# EAGLE schematic TSALC (EAGLE 9.3.0)
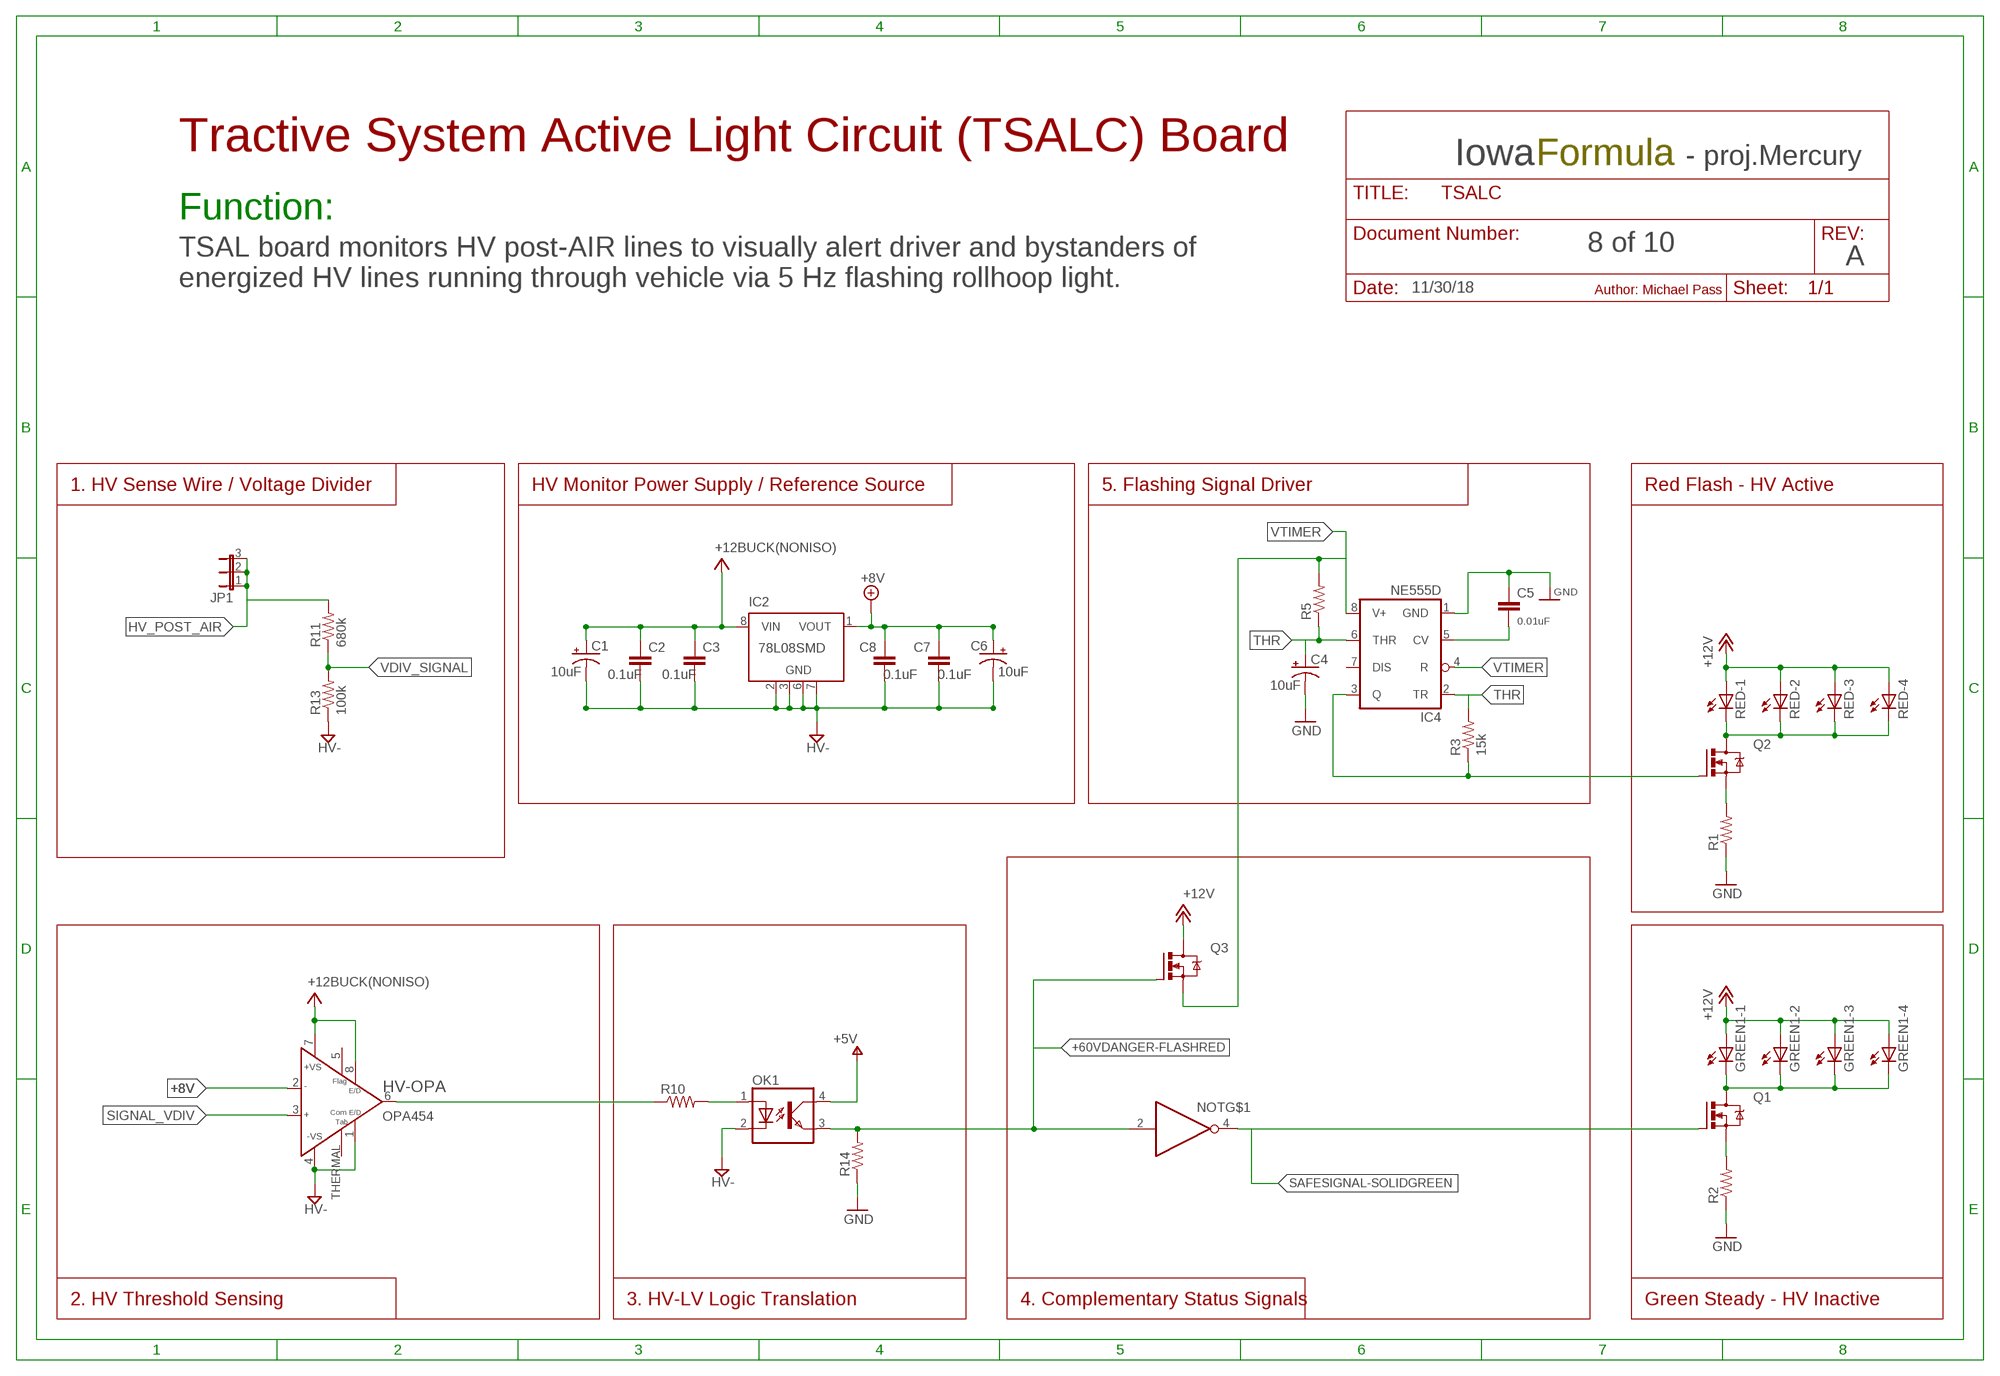
[diagram p0: schematic, sheet 1]

## Parts
C1  10uF  CPOL-US085CS-1AW  [085CS_1AW]
C2  0.1uF  C-EUC0805  [C0805]
C3  0.1uF  C-EUC0805  [C0805]
C4  10uF  CPOL-US085CS-1AW  [085CS_1AW]
C5  0.01uF  C-EUC0805  [C0805]
C6  10uF  CPOL-US085CS-1AW  [085CS_1AW]
C7  0.1uF  C-EUC0805  [C0805]
C8  0.1uF  C-EUC0805  [C0805]
GREEN1  LZR184  [LZR184]
HV-OPA  OPA454  [SO08GP]
IC2  78L08SMD  [SO08]
IC4  NE555D  [SO08]
JP1  JP2W  [JP2W]
NOT  74LVC1G06DCK  [SC70-5]
OK1  PC817-S  [SOP04(2.54)]
Q1  IRLZ44Z  [TO220BH]
Q2  IRLZ44Z  [TO220BH]
Q3  IRLZ44Z  [TO220BH]
R1  R-US_R0805  [R0805]
R2  R-US_R0805  [R0805]
R3  15k  R-US_R0805  [R0805]
R5  R-US_R0805  [R0805]
R10  R-US_R0805  [R0805]
R11  680k  R-US_R0805  [R0805]
R13  100k  R-US_R0805  [R0805]
R14  R-US_R0805  [R0805]
RED  LZR184  [LZR184]

## Nets
+8V: C6.+ C7.1 C8.1 HV-OPA.2(IN-) IC2.1(VOUT)
+12V: GREEN1.A1(-1:A) GREEN1.A2(-2:A) GREEN1.A3(-3:A) GREEN1.A4(-4:A) Q3.D RED.A1(-1:A) RED.A2(-2:A) RED.A3(-3:A) RED.A4(-4:A)
+60VDANGER-FLASHRED: NOT.2(I) OK1.3(EMIT) Q3.G R14.2
GND: C4.- C5.1 IC4.1(GND) OK1.2(C) R1.1 R2.1 R13.1 R14.1 ; supply symbol labelled HV-
HV-: C1.- C2.2 C3.2 C6.- C7.2 C8.2 HV-OPA.1(E/DCOM) HV-OPA.4(-VS) IC2.2(GND) IC2.3(GND) IC2.6(GND) IC2.7(GND)
HV_POST_AIR: JP1.1 JP1.2 JP1.3 R11.2
N$3: GREEN1.K1(-1:C) GREEN1.K2(-2:C) GREEN1.K3(-3:C) GREEN1.K4(-4:C) Q1.D
N$4: Q1.S R2.2
N$5: Q2.D RED.K1(-1:C) RED.K2(-2:C) RED.K3(-3:C) RED.K4(-4:C)
N$6: Q2.S R1.2
N$7: C5.2 IC4.5(CV)
N$8: IC4.3(Q) Q2.G R3.1
N$9: HV-OPA.6(OUT) R10.1
N$10: OK1.1(A) R10.2
SAFESIGNAL-SOLIDGREEN: NOT.4(O) Q1.G
SIGNAL_VDIV: HV-OPA.3(IN+)
THR: C4.+ IC4.2(TR) IC4.6(THR) R3.2 R5.1
V+: C1.+ C2.1 C3.1 HV-OPA.7(+VS) HV-OPA.8(E/D) IC2.8(VIN) OK1.4(COL) ; supply symbol labelled +12BUCK(NONISO), +5V
VDIV_SIGNAL: R11.1 R13.2
VTIMER: IC4.4(R) IC4.8(V+) Q3.S R5.2
Unconnected: HV-OPA.5(STATUS) HV-OPA.THERMAL(E/DCOM1) IC2.4(NC) IC2.5(NC) IC4.7(DIS)

## Notes on the sheet
- Tractive System Active Light Circuit (TSALC) Board
- Iowa | Formula | - proj.Mercury
- Function:
- 8 of 10
- A
- TSAL board monitors HV post-AIR lines to visually alert driver and bystanders of 
  energized HV lines running through vehicle via 5 Hz flashing rollhoop light.
- 11/30/18 | Author: Michael Pass
- 1. HV Sense Wire / Voltage Divider | HV Monitor Power Supply / Reference Source | 5. Flashing Signal Driver | Red Flash - HV Active
- 2. HV Threshold Sensing | 3. HV-LV Logic Translation | 4. Complementary Status Signals | Green Steady - HV Inactive

## Power pins joined to a net without a drawn wire
HV-: NOT.3(GND)
VCC: NOT.5(VCC)

## Library data of the parts
C1 C4 C6 = rcl:CPOL-US: POLARIZED CAPACITOR, American symbol; SPICEPREFIX: C
C2 C3 C5 C7 C8 = rcl:C-EU: CAPACITOR, European symbol; SPICEPREFIX: C
GREEN1 RED = led:LZR184: LED BLOCK 4 LEDs, Siemens
HV-OPA = OPA454:OPA454: TexasInstruments High-Voltage (100V), High-Current (50mA) Operatioanl Amplifier, G = 1 Stable http://focus.ti.com/lit/ds/symlink/opa454.pdf; AVAILABILITY: Unavailable; DESCRIPTION: High Voltage _100V_ High-Current _50mA_ Operational Amplifiers G=1 Stable; MF: Texas Instruments; MP: OPA454; PACKAGE: None; PRICE: None
IC2 = linear:78L*SMD: Positive VOLTAGE REGULATOR
IC4 = linear:*555: TIMER
JP1 = jumper:JP2W: JUMPER
NOT = 74xx-little-us:74*1G06: Single Inverter Buffer/Driver With Open-Drain Output
OK1 = iowaFormula:PC817-S: SHARP OPTO COUPLER
Q1-Q3 = transistor-power:IRLZ44Z: N-Channel HEXFET® Power MOSFET Logic Level AUTOMOTIVE MOSFET Source: http://www.irf.com/product-info/datasheets/data/irlz44zpbf.pdf
R1-R3 R5 R10 R11 R13 R14 = rcl:R-US_: RESISTOR, American symbol; SPICEPREFIX: R